# Altium project PCB_Project_Bit_Alignment_Tester.PrjPcb
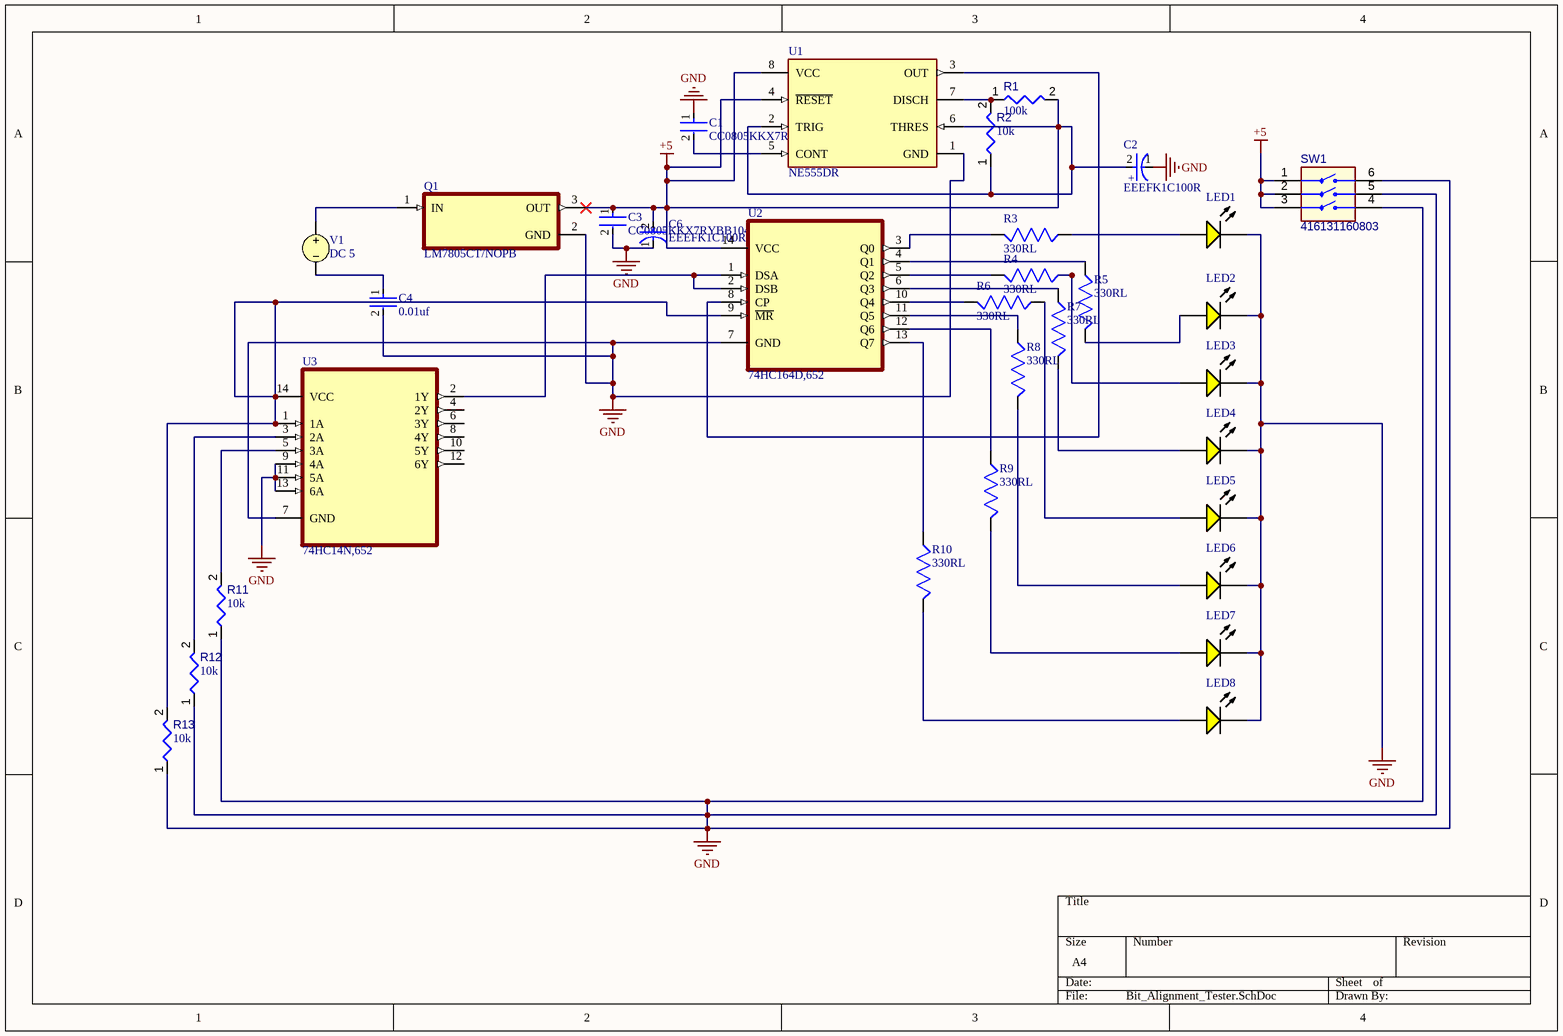
[diagram p0: Bit_Alignment_Tester.SchDoc]
1 sheet, 32 parts. Net scope: global (net labels, ports and power ports of the same name join across sheets).
Board file: PCB2.PcbDoc

## Sheet Bit_Alignment_Tester.SchDoc
size A4; SheetNumber: 1; SheetTotal: 1

### Parts
C1  CC0805KKX7RYBB104  [FP-CC0805-EB-MFG]
C2  EEEFK1C100R  [FP-FKB-MFG]
C3  CC0805KKX7RYBB104  [FP-CC0805-EB-MFG]
C4  0.01uf  [FP-CC0805-EB-MFG]
C6  EEEFK1C100R  [FP-FKB-MFG]
LED1  (no value)  [LTST-C190KSKT_V]
LED2  (no value)  [LTST-C190KSKT_V]
LED3  (no value)  [LTST-C190KSKT_V]
LED4  (no value)  [LTST-C190KSKT_V]
LED5  (no value)  [LTST-C190KSKT_V]
LED6  (no value)  [LTST-C190KSKT_V]
LED7  (no value)  [LTST-C190KSKT_V]
LED8  (no value)  [LTST-C190KSKT_V]
Q1  LM7805CT/NOPB  [TO254P1054X470X1955-3]
R1  value 100k  [RESC0402(1005)_L]  (hidden comment: Resistor 100K +/-1 % 0402 63 mW)
R2  value 10k  [RESC0402(1005)_L]  (hidden comment: Resistor 10K  +/-1 % 0402 63 mW)
R3  330RL  [RESC2012X60N]
R4  330RL  [RESC2012X60N]
R5  330RL  [RESC2012X60N]
R6  330RL  [RESC2012X60N]
R7  330RL  [RESC2012X60N]
R8  330RL  [RESC2012X60N]
R9  330RL  [RESC2012X60N]
R10  330RL  [RESC2012X60N]
R11  value 10k  [RESC0402(1005)_L]  (hidden comment: Resistor 10K  +/-1 % 0402 63 mW)
R12  value 10k  [RESC0402(1005)_L]  (hidden comment: Resistor 10K  +/-1 % 0402 63 mW)
R13  value 10k  [RESC0402(1005)_L]  (hidden comment: Resistor 10K  +/-1 % 0402 63 mW)
SW1  416131160803  [416131160803]
U1  NE555DR  [FP-D0008A-IPC_A]
U2  74HC164D,652  [SOIC127P600X175-14N]
U3  74HC14N,652  [DIP254P762X420-14]
V1  DC 5

### Nets
+5: C2.2(A) C3.1 C6.2(A) Q1.3(OUT) R1.2 R2.1 SW1.1 SW1.2 SW1.3 U1.2(TRIG) U1.4(~{RESET}) U1.6(THRES) U1.8(VCC) U2.14(VCC)
GND: C1.1 C2.1(C) C3.2 C4.2 C6.1(C) LED1.2(K) LED2.2(K) LED3.2(K) LED4.2(K) LED5.2(K) LED6.2(K) LED7.2(K) LED8.2(K) Q1.2(GND) R11.1 R12.1 R13.1 SW1.4 SW1.5 SW1.6 U1.1(GND) U2.7(GND) U3.7(GND) U3.9(4A) U3.11(5A) U3.13(6A)
NetC1_2: C1.2 U1.5(CONT)
NetC4_1: C4.1 V1.2
NetLED1_1: LED1.1(A) R3.2
NetLED2_1: LED2.1(A) R5.1
NetLED3_1: LED3.1(A) R4.2
NetLED4_1: LED4.1(A) R7.1
NetLED5_1: LED5.1(A) R6.2
NetLED6_1: LED6.1(A) R8.1
NetLED7_1: LED7.1(A) R9.1
NetLED8_1: LED8.1(A) R10.1
NetQ1_1: Q1.1(IN) V1.1
NetR1_1: R1.1 R2.2 U1.7(DISCH)
NetR3_1: R3.1 U2.3(Q0)
NetR4_1: R4.1 U2.5(Q2)
NetR5_2: R5.2 U2.4(Q1)
NetR6_1: R6.1 U2.10(Q4)
NetR7_2: R7.2 U2.6(Q3)
NetR8_2: R8.2 U2.11(Q5)
NetR9_2: R9.2 U2.12(Q6)
NetR10_2: R10.2 U2.13(Q7)
NetR11_2: R11.2 U3.5(3A)
NetR12_2: R12.2 U3.3(2A)
NetR13_2: R13.2 U2.9(~{MR}) U3.1(1A) U3.14(VCC)
NetU1_3: U1.3(OUT) U2.8(CP)
NetU2_1: U2.1(DSA) U2.2(DSB) U3.2(1Y)

Not connected (* = marked no-connect by the designer): U3 4(2Y) 6(3Y) 8(4Y) 10(5Y) 12(6Y)

### Notes on the sheet
- (in symbol CMP-05427-000100-1) +

### Library data of the parts
C1 C3 C4 = CMP-00621-107850848-1: CC0805KKX7RYBB104 Capacitor Ceramic 0.01uF 250V X7R 10% 0805 T/R; Capacitance: 100nF; Material: Ceramic; Max Operating Temperature: 125°C; Tolerance: 10%; Case/Package: 0805; NexarPartId: 107850848; Height: 1.45mm; Min Operating Temperature: -55°C; Voltage Rating: 250V
C2 C6 = CMP-05427-000100-1: CAP ALUM 10UF 20% 16V SMD; Ripple Current (AC): 90mA; Polarity: Polar; Dielectric Material: Aluminium; ESR (Equivalent Series Resistance): 1.35R; Leakage Current: 3uA; Life (Hours): 2000Hour; Number of Pins: 2; Package Quantity: 2000; Capacitance: 10uF; Termination: SMD/SMT; Diameter: 4mm; Max Operating Temperature: 105°C; Contact Plating: Tin; Mount: Surface Mount; Construction: Cylindrical; Voltage Rating (DC): 16V; Length: 5.8mm; Voltage: 16V; Ripple Current: 90mA; Packaging: Tape and Reel; Tolerance: 20%; Series: FK; Height: 5.8mm; Width: 5.5mm; Min Operating Temperature: -55°C; Lead Free: Lead Free; Impedance: 1.35R; REACH SVHC: No SVHC; Case/Package: Radial; Radiation Hardening: No; Height - Seated (Max): 0.24inch; Voltage Rating: 16V; RoHS Compliant: Yes
LED1-LED8 = CMP-007-00025-2: LED Uni-Color Yellow, 75 mW, 30 mA, -30 to 85 degC, 2-Pin SMD, RoHS, Tape and Reel; Manufacturer: Lite-On; Lens Style: Diffused; Forward Current: 20mA; Nominal Vf: 2.1V; Forward Voltage: 2V; Luminous Intensity: 28mcd; Viewing Angle: 130degrees; Power: 75mW; Case/Package: 0603; Datasheet URL: http://optoelectronics.liteon.com/upload/download/DS-22-99-0189/S_110_LTST-C190KSKT.pdf; Min Operating Temperature: -55°C; Illumination Colour: Yellow; Package Quantity: 3000; Datasheet Version: Rev. I, 10/2012; Colour: Yellow; Package Reference: C190KSKT; Package Description: 2-Pin Surface Mount Device, Body 1.6 x 0.8 mm; Max Operating Temperature: 85°C; Manufacturer URL: http://www.us.liteon.com/; Pins: 2; Mounting Technology: SM; RoHS Compliant: True; Packaging: TapeandReel
Q1 = LM7805CT/NOPB: MF: {'manufacturer': u'Texas Instruments'}; Package: None; Price: None; Value: *; MP: LM7805CT/NOPB; Availability: Unavailable
R1 = CMP-009-00168-3: Chip Resistor, 100 kOhms, +/-1 %, 63 mW, -55 to 155 degC, 0402; Tolerance: 1%; Power: 63mW; Max Operating Temperature: 155°C; Min Operating Temperature: -55°C; Pins: 2; Case/Package: 0402
R2 R11-R13 = CMP-009-00149-3: Chip Resistor, 10 kOhms, +/-1 %, 63 mW, -55 to 125 degC, 0402; Power: 63mW; Tolerance: 1%; Min Operating Temperature: -55°C; Case/Package: 0402; Max Operating Temperature: 155°C; Pins: 2
R3-R10 = RC0805FR-7W330RL: Package: None; MP: RC0805FR-7W330RL; Price: None; Value: *; Availability: Unavailable
SW1 = CMP-011-00012-3: WS-DISV 1.27 mm small compact SMD Dip Switch with top tape; ComponentLink1Description: Manufacturer URL; ComponentLink2Description: Datasheet; ComponentLink2URL: http://katalog.we-online.de/em/datasheet/4161311608xx.pdf; Pins: 6; ComponentLink1URL: http://www.we-online.com
U1 = CMP-1685-00007-2: IC OSC SGL TIMER 100KHZ 8-SOIC; Low Level Output Current: 200mA; Quiescent Current: 15mA; Min Supply Voltage: 4.5V; Number of Timers/Counters: 1; Max Supply Voltage: 16V; Operating Supply Current: 10mA; High Level Output Current: -200mA; Packaging: Tape and Reel; Frequency: 100kHz; Weight: 0.002561oz; REACH SVHC: No SVHC; Package Quantity: 2500; Width: 3.91mm; Max Operating Temperature: 70°C; Contact Plating: Gold; Lead Free: Lead Free; Number of Pins: 8; Min Operating Temperature: 0°C; Radiation Hardening: No; Length: 4.9mm; Case/Package: SOIC; Height: 1.58mm; Mount: Surface Mount
U2 = 74HC164D,652: Shift Shift Register 1 Element 8 Bit 14-SO; MF: Nexperia USA Inc.; SnapEDA_Link: https://www.snapeda.com/parts/74HC164D,652/Nexperia/view-part/?ref=snap; Package: SOIC-14 Nexperia USA; Value: *; MP: 74HC164D,652; Check_prices: https://www.snapeda.com/parts/74HC164D,652/Nexperia/view-part/?ref=eda
U3 = 74HC14N,652: Inverter IC 6 Channel Schmitt Trigger 14-DIP; MF: NXP USA; SnapEDA_Link: https://www.snapeda.com/parts/74HC14N,652/NXP+Semiconductors/view-part/?ref=snap; Package: DIP-14 Nexperia; Value: *; MP: 74HC14N,652; Check_prices: https://www.snapeda.com/parts/74HC14N,652/NXP+Semiconductors/view-part/?ref=eda
V1 = VSRC: Voltage Source; Note: PCB Footprint - Not required; AC Magnitude: 1; AC Phase: 0; Value: 5; Published: 8-Jun-2000; LatestRevisionDate: 17-Jul-2002; LatestRevisionNote: Re-released for DXP Platform.; PackageReference: Not Applicable; Publisher: Altium Limited